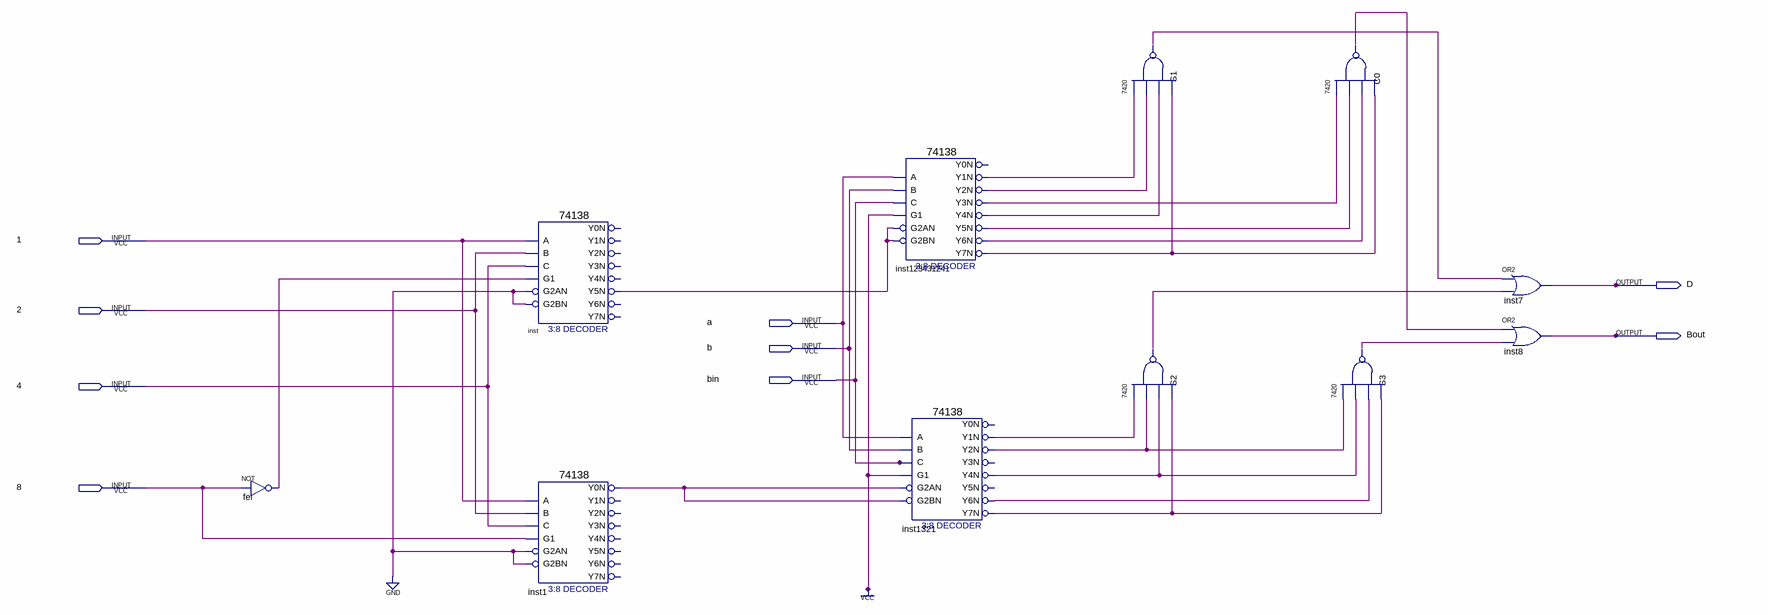
[diagram p0: schematic sheet]
// Quartus schematic 2_3.bdf as structural Verilog: 11 symbols, 9 pins
module \2_3  (
  input  \1 ,
  input  \2 ,
  input  a,
  input  b,
  input  bin,
  input  \4 ,
  input  \8 ,
  output D,
  output Bout
);

  wire C0_1, fei_out, inst1_y0n, inst1321_y1n, inst1321_y2n, inst1321_y4n, inst1321_y6n, inst1321_y7n,
       inst123431241_y1n, inst123431241_y2n, inst123431241_y3n, inst123431241_y4n, inst123431241_y5n,
       inst123431241_y6n, inst123431241_y7n, inst_y5n, S1_1, S2_1, S3_1;

  not fei (fei_out, \8 );
  \74138  inst (
    .A(\1 ), .B(\2 ), .G1(fei_out), .C(\4 ), .G2AN(1'b0), .G2BN(1'b0), .Y5N(inst_y5n));  // open: Y0N, Y1N, Y2N, Y3N, Y4N, Y6N, Y7N
  \74138  inst1 (
    .A(\1 ), .B(\2 ), .G1(\8 ), .C(\4 ), .G2AN(1'b0), .G2BN(1'b0), .Y0N(inst1_y0n));  // open: Y1N, Y2N, Y3N, Y4N, Y5N, Y6N, Y7N
  \74138  inst123431241 (
    .A(a), .B(b), .G1(1'b1), .C(bin), .G2AN(inst_y5n), .G2BN(inst_y5n), .Y1N(inst123431241_y1n),
    .Y2N(inst123431241_y2n), .Y3N(inst123431241_y3n), .Y4N(inst123431241_y4n), .Y5N(inst123431241_y5n),
    .Y6N(inst123431241_y6n), .Y7N(inst123431241_y7n));  // open: Y0N
  \74138  inst1321 (
    .A(a), .B(b), .G1(1'b1), .C(bin), .G2AN(inst1_y0n), .G2BN(inst1_y0n), .Y1N(inst1321_y1n),
    .Y2N(inst1321_y2n), .Y4N(inst1321_y4n), .Y6N(inst1321_y6n), .Y7N(inst1321_y7n));  // open: Y0N, Y3N, Y5N
  \7420  S1 (
    .\4 (inst123431241_y4n), .\2 (inst123431241_y1n), .\3 (inst123431241_y2n), .\5 (inst123431241_y7n),
    .\1 (S1_1));
  \7420  S2 (.\4 (inst1321_y4n), .\2 (inst1321_y1n), .\3 (inst1321_y2n), .\5 (inst1321_y7n), .\1 (S2_1));
  \7420  C0 (
    .\4 (inst123431241_y6n), .\2 (inst123431241_y3n), .\3 (inst123431241_y5n), .\5 (inst123431241_y7n),
    .\1 (C0_1));
  \7420  S3 (.\4 (inst1321_y6n), .\2 (inst1321_y2n), .\3 (inst1321_y4n), .\5 (inst1321_y7n), .\1 (S3_1));
  or inst7 (D, S1_1, S2_1);
  or inst8 (Bout, C0_1, S3_1);
endmodule
